# Altium schematic sheet POWER Amplifier.SchDoc
size A4
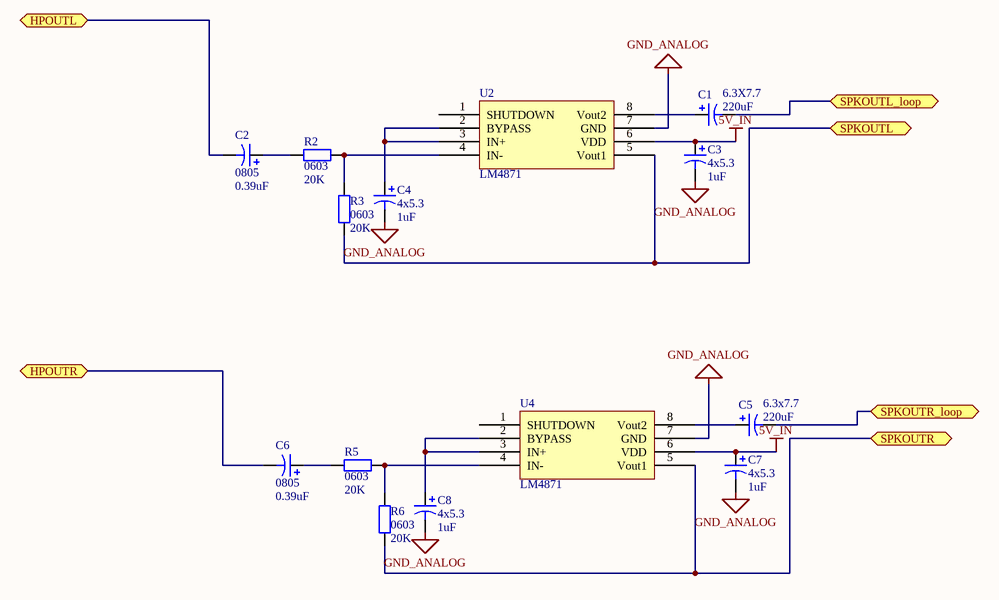
[diagram p0: POWER Amplifier.SchDoc]

## Parts
C1  6.3X7.7  value 220uF  [SMD Electrolytic Capacitors 6.3 X 7.7]
C2  0805  value 0.39uF  [0805]
C3  4x5.3  value 1uF  [SMD Electrolytic Capacitors 4X 5.3]
C4  4x5.3  value 1uF  [SMD Electrolytic Capacitors 4X 5.3]
C5  6.3x7.7  value 220uF  [SMD Electrolytic Capacitors 6.3 X 7.7]
C6  0805  value 0.39uF  [0805]
C7  4x5.3  value 1uF  [SMD Electrolytic Capacitors 4X 5.3]
C8  4x5.3  value 1uF  [SMD Electrolytic Capacitors 4X 5.3]
R2  0603  value 20K  [0603]
R3  0603  value 20K  [0603]
R5  0603  value 20K  [0603]
R6  0603  value 20K  [0603]
U2  LM4871  [LM4871M-SOP8]
U4  LM4871  [LM4871M-SOP8]

## Ports
HPOUTL, HPOUTR, SPKOUTL, SPKOUTL_loop, SPKOUTR, SPKOUTR_loop

## Nets
5V_IN: C3.1 C7.1 U2.6(VDD) U4.6(VDD)
GND_ANALOG: C3.2 C4.2 C7.2 C8.2 U2.7(GND) U4.7(GND)
HPOUTL: C2.2 ; port HPOUTL
HPOUTR: C6.2 ; port HPOUTR
SPKOUTL: R3.2 U2.5(Vout1) ; port SPKOUTL
SPKOUTL_loop: C1.2 ; port SPKOUTL_loop
SPKOUTR: R6.2 U4.5(Vout1) ; port SPKOUTR
SPKOUTR_loop: C5.2 ; port SPKOUTR_loop
NetC1_1: C1.1 U2.8(Vout2)
NetC2_1: C2.1 R2.2
NetC4_1: C4.1 U2.2(BYPASS) U2.3(IN+)
NetC5_1: C5.1 U4.8(Vout2)
NetC6_1: C6.1 R5.2
NetC8_1: C8.1 U4.2(BYPASS) U4.3(IN+)
NetR2_1: R2.1 R3.1 U2.4(IN-)
NetR5_1: R5.1 R6.1 U4.4(IN-)

Not connected (* = marked no-connect by the designer): U2 1(SHUTDOWN); U4 1(SHUTDOWN)

## Library data of the parts
C1-C8 = Cap Pol1: Polarized Capacitor (Radial); Published: 8-Jun-2000; LatestRevisionDate: 17-Jul-2002; LatestRevisionNote: Re-released for DXP Platform.; PackageReference: RB7.6-15; Publisher: Altium Limited
R2 R3 R5 R6 = Res2: Resistor; Published: 8-Jun-2000; LatestRevisionDate: 17-Jul-2002; LatestRevisionNote: Re-released for DXP Platform.; PackageReference: AXIAL-0.4; Publisher: Altium Limited